# EasyEDA Pro project 24Vto12V_2025-03-30_12-48-15.eprj

# Schematic Schematic1
Board Name: Board1; Create Date: 2025-03-30; Page Name: P1; Project Name: 24Vto12V_2025-03-30_12-48-15; Schematic Name: Schematic1; Update Date: 2025-03-30; Company: 嘉立创EDA; Drawed: 王大智; Page Size: A4; Version: V1.0
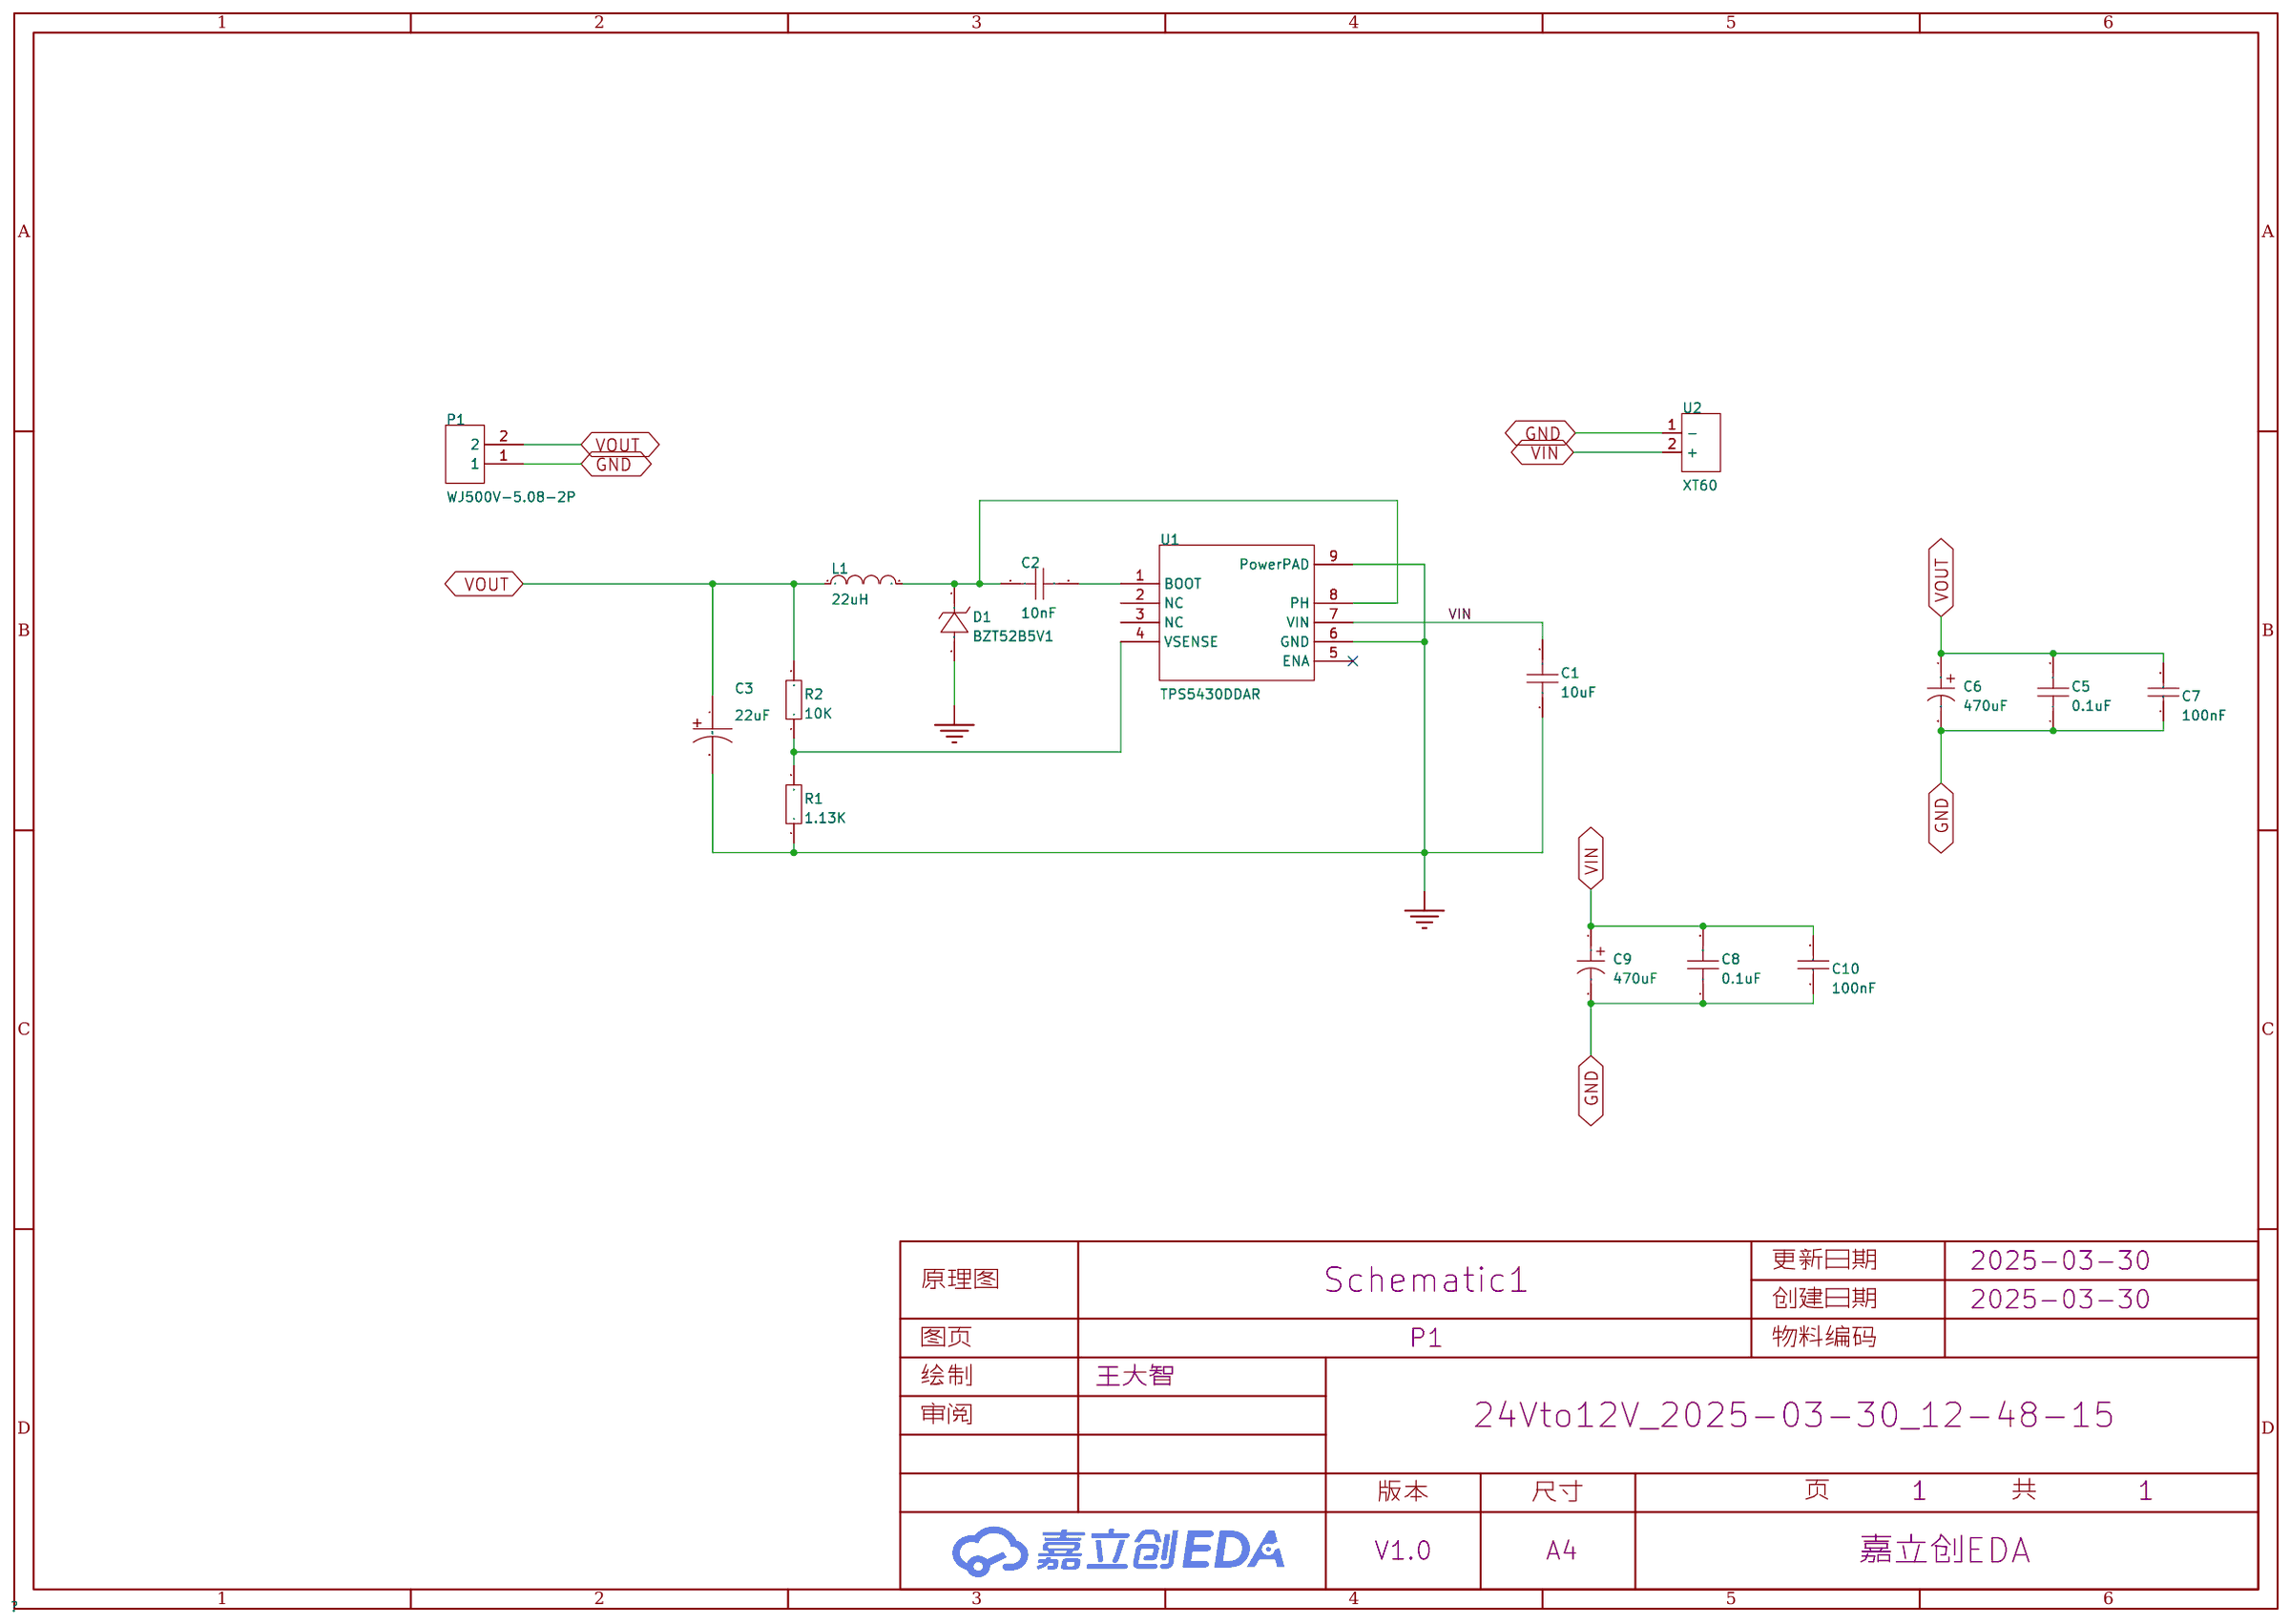
[diagram p0: schematic sheet]

## Parts
C1  10uF  [C0603]
C2  10nF  [C0603]
C3  22uF  [CAP-SMD_L3.5-W2.8-R-RD]
C5  0.1uF  [C0603]
C6  470uF  [CAP-TH_BD8.0-P3.50-D0.6-FD_1]
C7  100nF  [CAP-TH_L8.5-W5.0-P5.00-D1.2]
C8  0.1uF  [C0603]
C9  470uF  [CAP-TH_BD8.0-P3.50-D0.6-FD_1]
C10  100nF  [CAP-TH_L8.5-W5.0-P5.00-D1.2]
D1  BZT52B5V1  [SOD-123_L2.7-W1.6-LS3.7-RD]
L1  22uH  [L0603]
P1  WJ500V-5.08-2P  [CONN-TH_2P-P5.00_WJ500V-5.08-2P]
R1  1.13K  [R0603]
R2  10K  [R0603]
U1  TPS5430DDAR  [ESOP-8_L4.9-W3.9-P1.27-LS6.0-TL-EP]
U2  XT60  [CONN-TH_XT60]

## Library data of the parts
C1 C2 C5 C8 = CAP_0603: Supplier Footprint: 0603
C3 = TPSB226K020R0400: LCSC Part Name: 22uF ±10% 20V; Supplier Part: C308917; Manufacturer: Kyocera AVX; Supplier Footprint: CASE-B-3528-21(mm); JLCPCB Part Class: 扩展库; Datasheet: https://atta.szlcsc.com/upload/public/pdf/source/20190626/C400103_28AE209020E7532C1D8166E9B4B580CB.pdf; Supplier: LCSC; Tolerance: ±10%; Rated Voltage: 20V; Equivalent Series Resistance(ESR): 400mΩ@100kHz; Operating Temperature: -55℃~+125℃
C6 C9 = CD2884771EM0812VFL: LCSC Part Name: 470uF 25V; Supplier Part: C2960233; Manufacturer: HRK(鸿瑞凯电子); Supplier Footprint: 插件,D8xL12mm; JLCPCB Part Class: 扩展库; Datasheet: https://atta.szlcsc.com/upload/public/pdf/source/20240703/D49961C1CEC6E325964F7113D69E9087.pdf; Supplier: LCSC; Rated Voltage: 25V; φD: 8mm; L: 12mm; Operating Temperature: -40℃~+105℃
C7 C10 = CT4-0805Y104M500F3: LCSC Part Name: 100nF ±20% 50V; Supplier Part: C94717; Manufacturer: FH(风华); Supplier Footprint: 插件,P=5.08mm; JLCPCB Part Class: 扩展库; Datasheet: https://atta.szlcsc.com/upload/public/pdf/source/20190402/C385200_059806A6312B28FF1421A2413EB641E1.pdf; Supplier: LCSC; Tolerance: ±20%; Voltage Rated: 50V; Temperature Coefficient: Y5V
D1 = BZT52B5V1_C19077393: Supplier Part: C19077393; Manufacturer: 宏嘉诚; Supplier Footprint: SOD-123; JLCPCB Part Class: 扩展库; Datasheet: https://atta.szlcsc.com/upload/public/pdf/source/20250106/AFD01FE5B0C707EDCEE558C585303F64.pdf; Supplier: LCSC; Diode Configuration: 独立式; Zener Voltage(Nom): 5.1V; Reverse Leakage Current (Ir): 2uA@2V; Zener Voltage(Range): 5V~5.2V; Pd - Power Dissipation(Pd): 500mW; Impedance(Zzt): 60Ω
L1 = L_0603
P1 = WJ500V-5.08-2P: LCSC Part Name: 1x2P 5.08mm 直插 排数:1 每排P数:2; Supplier Part: C8465; Manufacturer: KANGNEX(康奈克斯电气); Supplier Footprint: 插件,P=5.08mm; JLCPCB Part Class: 扩展库; Datasheet: https://atta.szlcsc.com/upload/public/pdf/source/20191225/C8465_02D34CE5B5B4A53DF5891601D97FA9F4.pdf; Supplier: LCSC; Structure: 1x2P; Pitch: 5.08mm; Color: 绿色; Mounting Style: 直插; Current Rating (Max): 18A; Voltage Rating (Max): 250V; Number of Pins: 2P; Number of Rows: 1; Wire Gauge - AWG: 14~30; Wire Gauge - mm2: 2.5; Number of PINs Per Row: 2; Operating Temperature Range: -40℃~+105℃; Screw Specification: M2.5
R1 R2 = Res_0603: Supplier Footprint: 0603
U1 = TPS5430DDAR: LCSC Part Name: 宽输入范围、3A输出电流的降压转换器; Supplier Part: C9864; Manufacturer: TI(德州仪器); Supplier Footprint: SOIC-8-EP; JLCPCB Part Class: 基础库; Datasheet: https://www.ti.com/cn/lit/gpn/tps5430; Supplier: LCSC; Function: 降压型; Output Type: 可调; Input Voltage: 5.5V~36V; Output Voltage: 1.221V~32.04V; Output Current: 3A; Switching Frequency: 500kHz; Operating Temperature: -40℃~+125℃@(TJ); Synchronous Rectification: 否; Number of Outputs: 1; Topology: 降压式; Switch tube (built-in/external): 内置
U2 = XT60: LCSC Part Name: AMASS(艾迈斯) XT60模型插头 3.5mm镀金香蕉头公头（电调端）XT60-M; Supplier Part: C98733; Manufacturer: AMASS(艾迈斯); JLCPCB Part Class: 扩展库; Datasheet: https://atta.szlcsc.com/upload/public/pdf/source/20170606/1496716524919.pdf; Supplier: LCSC; Brand: 艾迈斯; Type: 香蕉头; Colour: 黄色; InterfaceType: 公头; specifications: 3.5mm

## Nets
GND: C1.1 C3.2 C5.1 C6.2 C7.1 C8.1 C9.2 C10.1 D1.2(A) P1.1 R1.1 U1.6(GND) U1.9(PowerPAD) U2.1(-)
VIN: C1.2 C8.2 C9.1 C10.2 U1.7(VIN) U2.2(+)
VOUT: C3.1 C5.2 C6.1 C7.2 L1.1 P1.2 R2.2
$1N608: C2.2 U1.1(BOOT)
$1N612: C2.1 D1.1(K) L1.2 U1.8(PH)
$1N729: R1.2 R2.1 U1.4(VSENSE)

Not connected (* = marked no-connect by the designer): U1 2(NC) 3(NC) 5(ENA)*

# Board PCB1
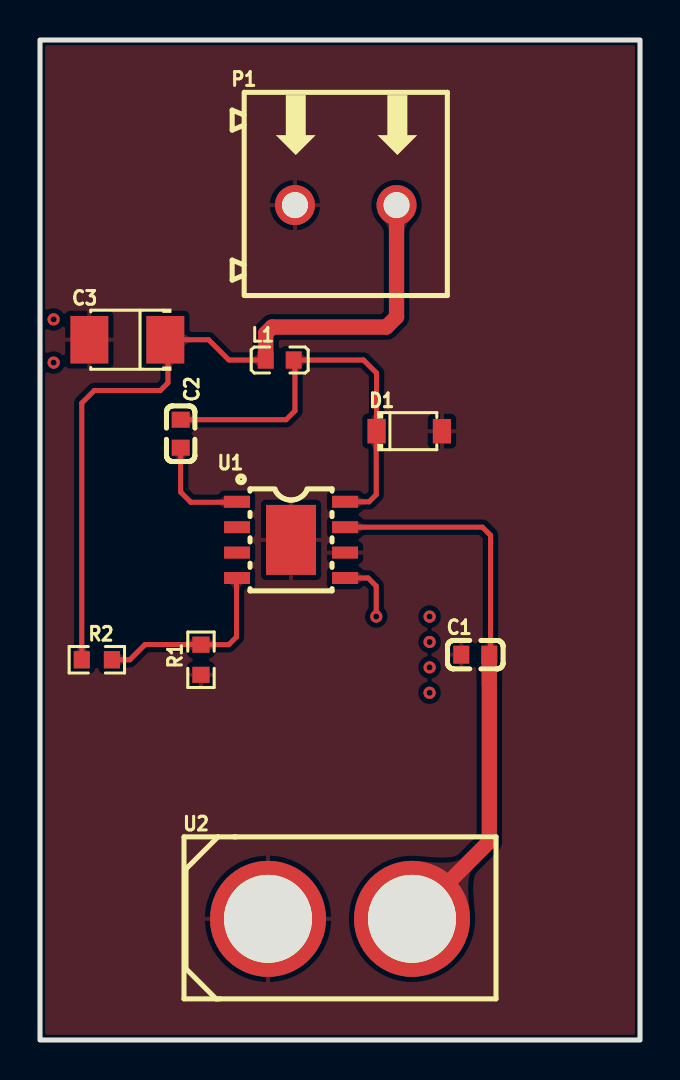
[diagram p1: board, top side]
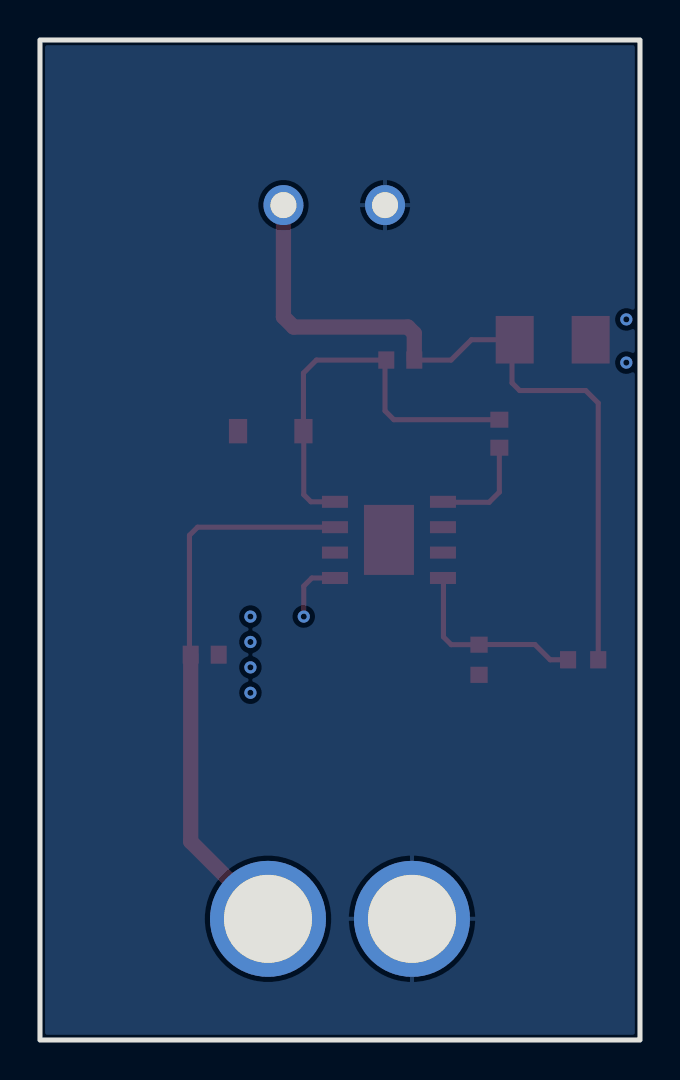
[diagram p2: board, bottom side, seen from below]

Outline 30 x 50 mm; copper layers: Top Layer, Bottom Layer. Coordinates in mm from the lower left corner of the outline.
Outline path: rectangle 0,50 30,0
Stack: Top Layer 0.035mm / Dielectric1 1.51mm FR4 er 4.5 / Bottom Layer 0.035mm

## Design rules (mm)
template: JLCPCB Capability(Two Layers Board)
spacing copperThickness1oz (default): track to track 0.102, other pairs 0.152 to 0.3
spacing copperThickness2oz: track to track 0.203, other pairs 0.152 to 0.3
track width copperThickness1oz (default): min 0.127, default 0.254, max 2.54
track width copperThickness2oz: min 0.203, default 0.254, max 2.54
differential pair differentialPair (default): width min 0.127, default 0.254, max 2.54; gap min 0.152, default 0.152
via viaSize (default): diameter min 0.5, default 0.61, max 10; hole min 0.3, default 0.305, max 6.3

## Placement (name value [footprint] x y rotation side)
C1  10uF  [C0603]  21.76 19.27 0 top
C2  10nF  [C0603]  7.03 30.31 270 top
C3  22uF  [CAP-SMD_L3.5-W2.8-R-RD]  4.37 35.01 0 top
D1  BZT52B5V1  [SOD-123_L2.7-W1.6-LS3.7-RD]  18.46 30.44 0 top
L1  22uH  [L0603]  11.99 34 0 top
P1  WJ500V-5.08-2P  [CONN-TH_2P-P5.00_WJ500V-5.08-2P]  15.29 41.75 0 top
R1  1.13K  [R0603]  8.05 19.01 90 top
R2  10K  [R0603]  2.84 19.01 180 top
U1  TPS5430DDAR  [ESOP-8_L4.9-W3.9-P1.27-LS6.0-TL-EP]  12.55 25.01 0 top
U2  XT60  [CONN-TH_XT60]  15 6.06 0 top

## Footprints (pads in the part's own frame, mm; a bottom-side part is the same pattern mirrored in y, then rotated)
C0603
  rect 0.8x0.9 smd: 1(-0.7,0) 2(0.7,0)
CAP-SMD_L3.5-W2.8-R-RD
  rect 1.9x2.376 smd: 1(1.899,0) 2(-1.899,0)
CONN-TH_2P-P5.00_WJ500V-5.08-2P
  round 2 hole 1.3: 1(-2.54,0) 2(2.54,0)
CONN-TH_XT60
  round 5.8 hole 4.4: 1(-3.6,0) 2(3.6,0)
ESOP-8_L4.9-W3.9-P1.27-LS6.0-TL-EP
  rect 1.3x0.6 smd: 1(-2.7,1.905) 2(-2.7,0.635) 3(-2.7,-0.635) 4(-2.7,-1.905) 5(2.7,-1.905) 6(2.7,-0.635) 7(2.7,0.635) 8(2.7,1.905)
  rect 2.5x3.5 smd: 9(0,0)
L0603
  rect 0.8x0.864 smd: 1(-0.7,0) 2(0.7,0)
R0603
  rect 0.806x0.864 smd: 1(-0.753,0) 2(0.753,0)
SOD-123_L2.7-W1.6-LS3.7-RD
  rect 0.91x1.22 smd: 1(-1.635,0) 2(1.635,0)

## Nets
As in the schematic.

Pads without a net: U1 2 3 5

## Via types
v1: diameter 0.61, hole 0.305, Top Layer to Bottom Layer, 7 vias

## Routing (per net, layer and track width the routed paths; a pad name or vN(x,y) marks a point on that pad's centre or on a via; arc(x,y) is an arc through that point)
VIN: length 28.2
  Top Layer w0.254: C1.2 22.53,19.33 22.53,25.23 22.12,25.64 U1.7
  Top Layer w0.762: C1.2 22.46,9.92 U2.2
(no net): length 3.3
  Top Layer w0.254: v1(16.81,21.17) 16.81,22.69 16.41,23.1 U1.5
  vias: v1(0.68,36.03) v1(0.68,33.87) v1(19.48,21.17) v1(19.48,19.9) v1(19.48,18.63) v1(19.48,17.36)
VOUT: length 39
  Top Layer w0.254: R2.2 2.09,31.85 2.71,32.47 6.02,32.47 6.4,32.86 6.4,34.88 C3.1 8.43,35.01 9.45,34 L1.1
  Top Layer w0.762: L1.1 11.29,35.33 11.6,35.65 17.32,35.65 17.83,36.16 P1.2
$1N608: length 5.3
  Top Layer w0.254: U1.1 9.83,26.89 7.54,26.89 7.03,27.39 C2.2
$1N612: length 20.7
  Top Layer w0.254: C2.1 12.3,31.02 12.75,31.46 12.75,33.94 L1.2 16.18,34 16.83,33.35 D1.1 16.81,30.43 16.81,27.27 16.46,26.91 U1.8
$1N729: length 9.7
  Top Layer w0.254: U1.4 9.83,23.08 9.83,20.16 9.44,19.77 R1.2 8.04,19.77 5.25,19.77 4.49,19.01 R2.1

## Copper pours and planes (outline as drawn; the poured copper is in the pictures)
GND on Top Layer: -6.18,53.94 35.48,53.94 35.48,-7.15 -6.18,-7.15
GND on Bottom Layer: -8.33,54.19 38.27,54.19 38.27,-3.72 -8.33,-3.72

Small or netless copper shapes (teardrops, artwork), in the pictures only: 24 on Top Layer
